# Altium project Gateway.PrjPCB
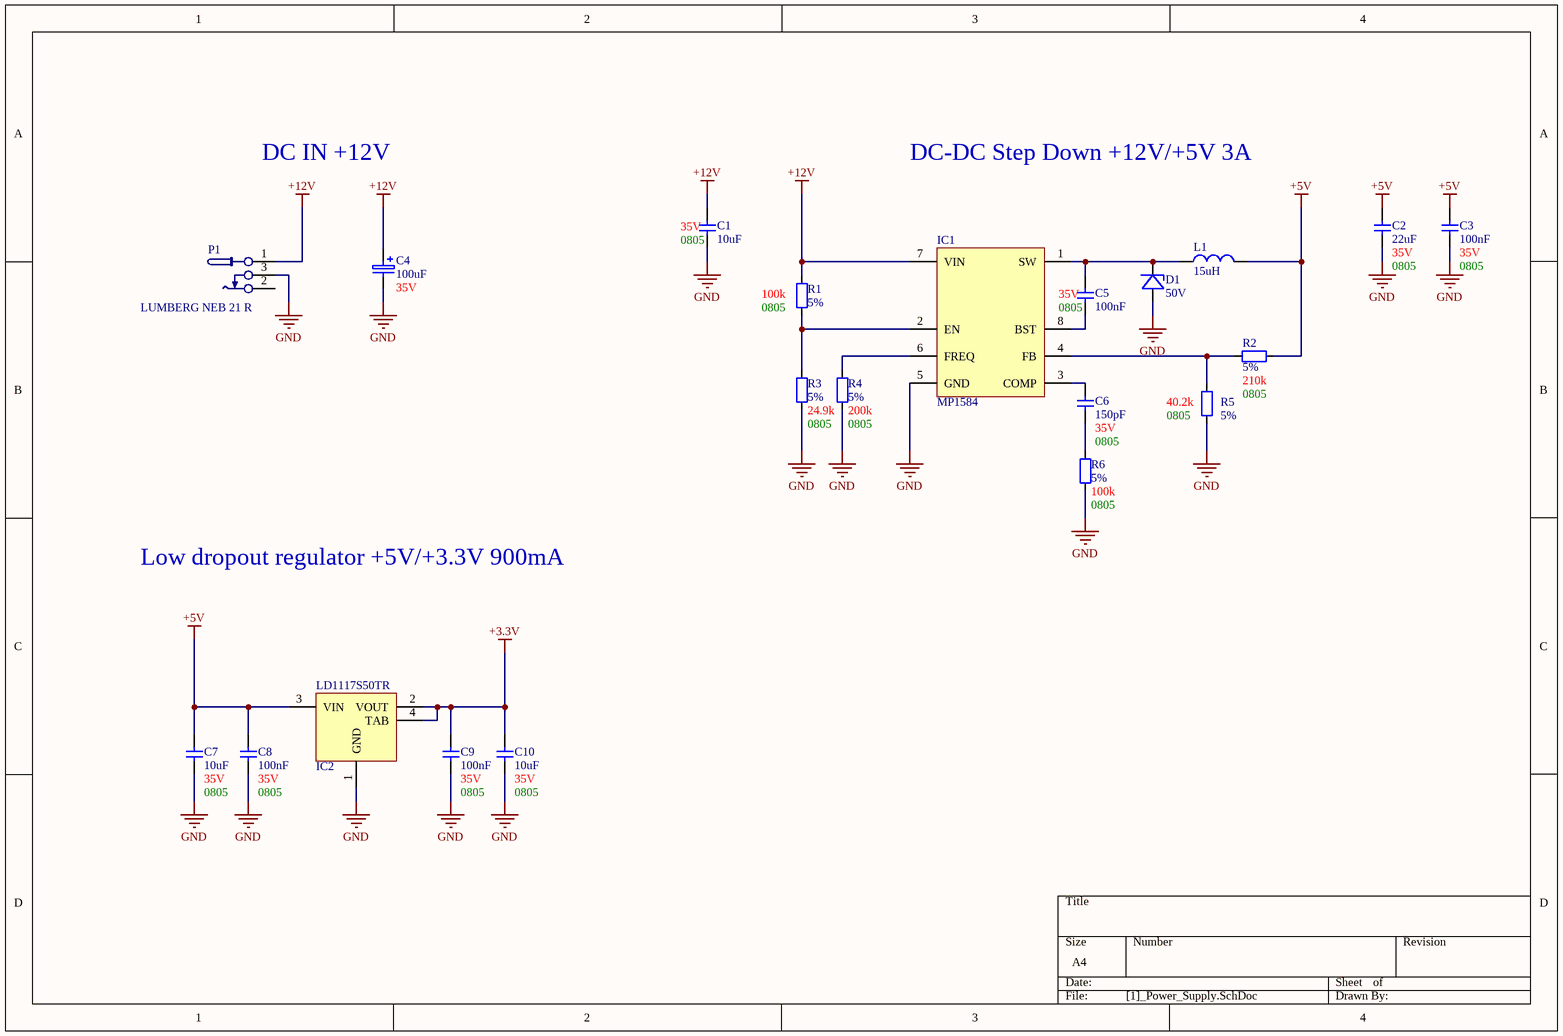
[diagram p0: [1]_Power_Supply.SchDoc]
4 sheets, 52 parts. Net scope: global (net labels, ports and power ports of the same name join across sheets).
Board file: PCB.PcbDoc
Sheets:
  [1]_Power_Supply.SchDoc
  [2]_PI_ZERO.SchDoc
  [3]_ENC28J60.SchDoc
  [4]_RFM95W.SchDoc

## Sheet [1]_Power_Supply.SchDoc
size A4

### Parts
C1  value 10uF  Voltage: 35V  Package: 0805  [Capacitor_0805]  (hidden comment: Capacitor SMD 0805)
C2  value 22uF  Voltage: 35V  Package: 0805  [Capacitor_0805]  (hidden comment: Capacitor SMD 0805)
C3  value 100nF  Voltage: 35V  Package: 0805  [Capacitor_0805]  (hidden comment: Capacitor SMD 0805)
C4  value 100uF  Voltage: 35V  [CAP_EL5x5.4mm]  (hidden comment: Polarized capacitor SMD  5x5.4mm)
C5  value 100nF  Voltage: 35V  Package: 0805  [Capacitor_0805]  (hidden comment: Capacitor SMD 0805)
C6  value 150pF  Voltage: 35V  Package: 0805  [Capacitor_0805]  (hidden comment: Capacitor SMD 0805)
C7  value 10uF  Voltage: 35V  Package: 0805  [Capacitor_0805]  (hidden comment: Capacitor SMD 0805)
C8  value 100nF  Voltage: 35V  Package: 0805  [Capacitor_0805]  (hidden comment: Capacitor SMD 0805)
C9  value 100nF  Voltage: 35V  Package: 0805  [Capacitor_0805]  (hidden comment: Capacitor SMD 0805)
C10  value 10uF  Voltage: 35V  Package: 0805  [Capacitor_0805]  (hidden comment: Capacitor SMD 0805)
D1  50V  [DO214-AA]
IC1  MP1584  [SOP8E]
IC2  LD1117S50TR  [SOT-223]
L1  15uH  [SDR0604-150YL]
P1  LUMBERG NEB 21 R  [LUMBERG_NEB_21R]
R1  Tolerance: 5%  Package: 0805  [R_0805]  (hidden comment: 100k)
R2  Tolerance: 5%  Package: 0805  [R_0805]  (hidden comment: 210k)
R3  Tolerance: 5%  Package: 0805  [R_0805]  (hidden comment: 24.9k)
R4  Tolerance: 5%  Package: 0805  [R_0805]  (hidden comment: 200k)
R5  Tolerance: 5%  Package: 0805  [R_0805]  (hidden comment: 40.2k)
R6  Tolerance: 5%  Package: 0805  [R_0805]  (hidden comment: 100k)

### Nets
+3.3V: C9.2 C10.1 IC2.2(VOUT) IC2.4(TAB)
+5V: C2.2 C3.2 C7.2 C8.1 IC2.3(VIN) L1.2 R2.2
+12V: C1.2 C4.1 IC1.7(VIN) P1.1 R1.2
GND: C1.1 C2.1 C3.1 C4.2 C7.1 C8.2 C9.1 C10.2 D1.A IC1.5(GND) IC1.9(THERM) IC2.1(GND) P1.3 R3.1 R4.1 R5.1 R6.1
NetC5_1: C5.1 IC1.8(BST)
NetC5_2: C5.2 D1.C IC1.1(SW) L1.1
NetC6_1: C6.1 R6.2
NetC6_2: C6.2 IC1.3(COMP)
NetIC1_2: IC1.2(EN) R1.1 R3.2
NetIC1_4: IC1.4(FB) R2.1 R5.2
NetIC1_6: IC1.6(FREQ) R4.2

Not connected (* = marked no-connect by the designer): P1 2

### Notes on the sheet
- Labels drawn without touching a wire or pin: DC IN +12V, DC-DC Step Down +12V/+5V 3A, Low dropout regulator +5V/+3.3V 900mA

### Library data of the parts
C1-C3 C5-C10 = Capacitor SMD 0805: Ceramic Capacitor SMD 0805; Tolerance: 10%
C4 = Polarized capacitor SMD  5x5.4mm: Electrolytic Capacitor SMD 5x5.4mm
D1 = Diode Rectifier RS3AB-13-F: RS3AB-13-F -Diode Standard 50V 3A Surface Mount SMB; MaxCurrent: Current
IC1 = MP1584: MP1584_3A, 1.5MHz, 28V_Step-Down Converter
IC2 = LD1117S50TR: LD1117S50TR - Fixed low drop positive voltage regulator
L1 = SDR0604-150YL: SDR0604-150YL - SMD Power Inductors
P1 = LUMBERG NEB 21 R: LUMBERG NEB 21 R DC Power Connector
R1-R6 = Resistor SMD 0805
  R1 R6: Value: 100k
  R2: Value: 210k
  R3: Value: 24.9k
  R4: Value: 200k
  R5: Value: 40.2k

## Sheet [2]_PI_ZERO.SchDoc
size A4
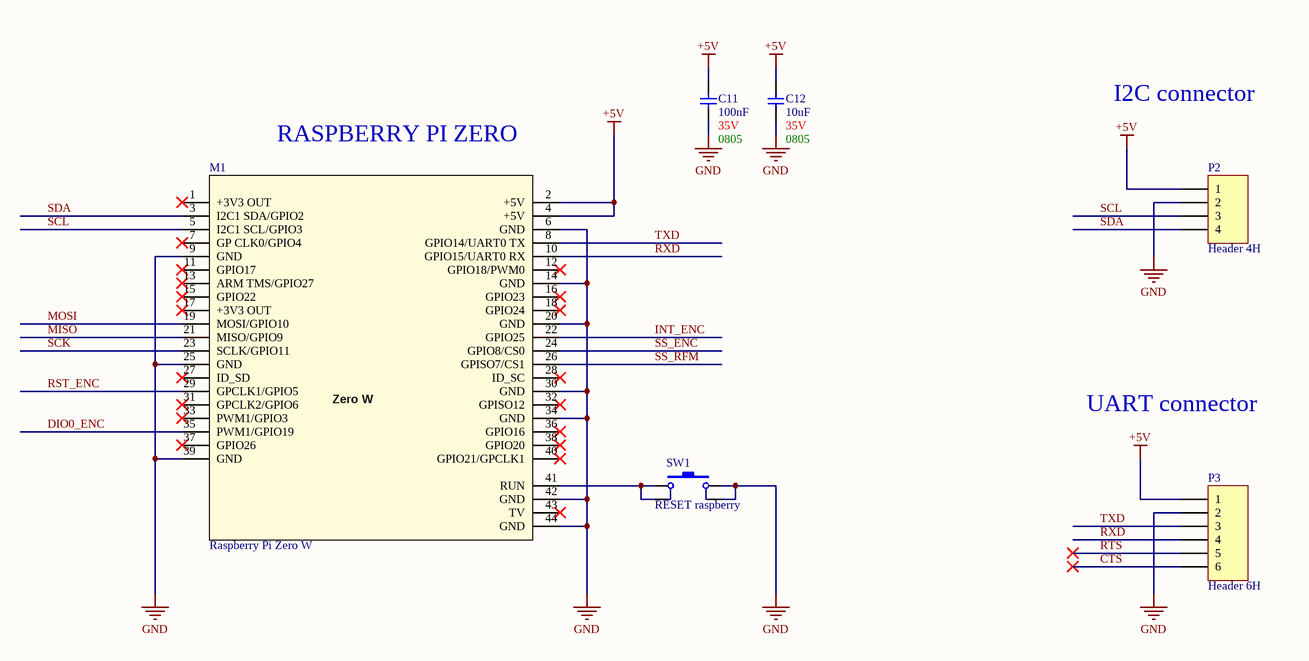
[diagram p1: [2]_PI_ZERO.SchDoc]

### Parts
C11  value 100nF  Voltage: 35V  Package: 0805  [Capacitor_0805]  (hidden comment: Capacitor SMD 0805)
C12  value 10uF  Voltage: 35V  Package: 0805  [Capacitor_0805]  (hidden comment: Capacitor SMD 0805)
M1  Raspberry Pi Zero W  [RPi-zero]
P2  Header 4H  [HDR1X4]
P3  Header 6H  [HDR1X6]
SW1  RESET raspberry  [Tact_SWITCH 6x6mm]

### Nets
+5V: C11.2 C12.2 M1.2(+5V) M1.4(+5V) P2.1 P3.1
GND: C11.1 C12.1 M1.6(GND) M1.9(GND) M1.14(GND) M1.20(GND) M1.25(GND) M1.30(GND) M1.34(GND) M1.39(GND) M1.42(GND) M1.44(GND) M1.45(M) M1.46(M) M1.47(M) M1.48(M) P2.2 P3.2 SW1.3 SW1.4
CTS: P3.6
DIO0_ENC: M1.35(PWM1/GPIO19)
INT_ENC: M1.22(GPIO25)
MISO: M1.21(MISO/GPIO9)
MOSI: M1.19(MOSI/GPIO10)
RST_ENC: M1.29(GPCLK1/GPIO5)
RTS: P3.5
RXD: M1.10(GPIO15/UART0_RX) P3.4
SCK: M1.23(SCLK/GPIO11)
SCL: M1.5(I2C1_SCL/GPIO3) P2.3
SDA: M1.3(I2C1_SDA/GPIO2) P2.4
SS_ENC: M1.24(GPIO8/CS0)
SS_RFM: M1.26(GPISO7/CS1)
TXD: M1.8(GPIO14/UART0_TX) P3.3
NetM1_41: M1.41(RUN) SW1.1 SW1.2

Not connected (* = marked no-connect by the designer): M1 1(+3V3_OUT)* 7(GP_CLK0/GPIO4)* 11(GPIO17)* 12(GPIO18/PWM0)* 13(ARM_TMS/GPIO27)* 15(GPIO22)* 16(GPIO23)* 17(+3V3_OUT)* 18(GPIO24)* 27(ID_SD)* 28(ID_SC)* 31(GPCLK2/GPIO6)* 32(GPISO12)* 33(PWM1/GPIO3)* 36(GPIO16)* 37(GPIO26)* 38(GPIO20)* 40(GPIO21/GPCLK1)* 43(TV)*

### Notes on the sheet
- Labels drawn without touching a wire or pin: I2C connector, RASPBERRY PI ZERO, UART connector
- (in symbol Raspberry Pi Zero W) Zero W

### Library data of the parts
C11 C12 = Capacitor SMD 0805: as C1 on sheet [1]_Power_Supply
M1 = Raspberry Pi Zero W: Raspberry Pi Zero W module
P2 = Header 4: Header, 4-Pin; LatestRevisionDate: 17-Jul-2002; LatestRevisionNote: Re-released for DXP Platform.; Publisher: Altium Limited
P3 = Header 6: Header, 6-Pin; LatestRevisionDate: 17-Jul-2002; LatestRevisionNote: Re-released for DXP Platform.; Publisher: Altium Limited
SW1 = Switch 6x6mm SMD SPST-NO: SCHURTER 1301.9315 - 6x6 mm tact switches

## Sheet [3]_ENC28J60.SchDoc
size A4
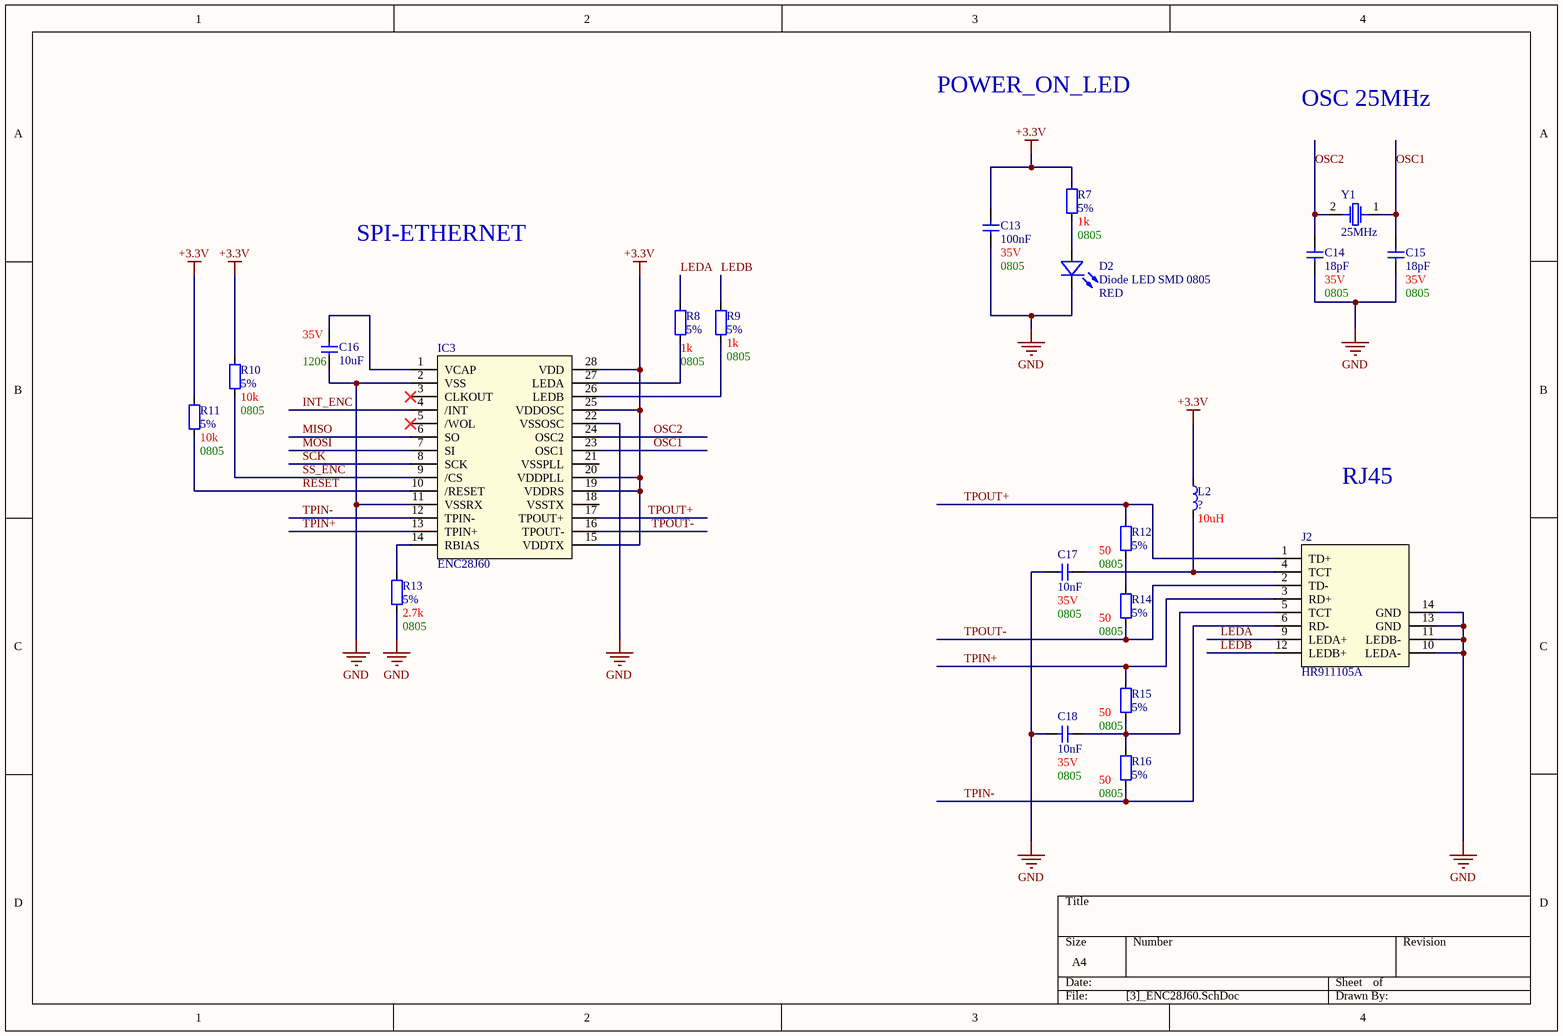
[diagram p2: [3]_ENC28J60.SchDoc]

### Parts
C13  value 100nF  Voltage: 35V  Package: 0805  [Capacitor_0805]  (hidden comment: Capacitor SMD 0805)
C14  value 18pF  Voltage: 35V  Package: 0805  [Capacitor_0805]  (hidden comment: Capacitor SMD 0805)
C15  value 18pF  Voltage: 35V  Package: 0805  [Capacitor_0805]  (hidden comment: Capacitor SMD 0805)
C16  value 10uF  Voltage: 35V  Package: 1206  [CAP_SMD_1206]  (hidden comment: Capacitor SMD 1206)
C17  value 10nF  Voltage: 35V  Package: 0805  [Capacitor_0805]  (hidden comment: Capacitor SMD 0805)
C18  value 10nF  Voltage: 35V  Package: 0805  [Capacitor_0805]  (hidden comment: Capacitor SMD 0805)
D2  Diode LED SMD 0805  Colour: RED  [Diode_LED_SMD_0805]
IC3  ENC28J60  [SO-28W]
J2  HR911105A  [HR911105A]
L2  ?  value 10uH  [IND_IHLP2525]
R7  Tolerance: 5%  Package: 0805  [R_0805]  (hidden comment: 1k)
R8  Tolerance: 5%  Package: 0805  [R_0805]  (hidden comment: 1k)
R9  Tolerance: 5%  Package: 0805  [R_0805]  (hidden comment: 1k)
R10  Tolerance: 5%  Package: 0805  [R_0805]  (hidden comment: 10k)
R11  Tolerance: 5%  Package: 0805  [R_0805]  (hidden comment: 10k)
R12  Tolerance: 5%  Package: 0805  [R_0805]  (hidden comment: 50)
R13  Tolerance: 5%  Package: 0805  [R_0805]  (hidden comment: 2.7k)
R14  Tolerance: 5%  Package: 0805  [R_0805]  (hidden comment: 50)
R15  Tolerance: 5%  Package: 0805  [R_0805]  (hidden comment: 50)
R16  Tolerance: 5%  Package: 0805  [R_0805]  (hidden comment: 50)
Y1  value 25MHz  [HC49SM]  (hidden comment: HC49SM)

### Nets
+3.3V: C13.2 IC3.15(VDDTX) IC3.19(VDDRS) IC3.20(VDDPLL) IC3.25(VDDOSC) IC3.28(VDD) L2.1 R7.2 R10.2 R11.1
GND: C13.1 C14.2 C15.2 C16.1 C17.1 C18.1 D2.C IC3.2(VSS) IC3.11(VSSRX) IC3.22(VSSOSC) J2.10(LEDA-) J2.11(LEDB-) J2.13(GND) J2.14(GND) R13.1
INT_ENC: IC3.4(/INT)
LEDA: J2.9(LEDA+) R8.2
LEDB: J2.12(LEDB+) R9.2
MISO: IC3.6(SO)
MOSI: IC3.7(SI)
OSC1: C15.1 IC3.23(OSC1) Y1.1
OSC2: C14.1 IC3.24(OSC2) Y1.2
RESET: IC3.10(/RESET) R11.2
SCK: IC3.8(SCK)
SS_ENC: IC3.9(/CS) R10.1
TPIN+: IC3.13(TPIN+) J2.3(RD+) R15.2
TPIN-: IC3.12(TPIN-) J2.6(RD-) R16.1
TPOUT+: IC3.17(TPOUT+) J2.1(TD+) R12.2
TPOUT-: IC3.16(TPOUT-) J2.2(TD-) R14.1
NetC16_2: C16.2 IC3.1(VCAP)
NetC17_2: C17.2 J2.4(TCT) L2.2
NetC18_2: C18.2 J2.5(TCT) R15.1 R16.2
NetD2_A: D2.A R7.1
NetIC3_14: IC3.14(RBIAS) R13.2
NetIC3_26: IC3.26(LEDB) R9.1
NetIC3_27: IC3.27(LEDA) R8.1
NetR12_1: R12.1 R14.2

Not connected (* = marked no-connect by the designer): IC3 3(CLKOUT)* 5(/WOL)* 18(VSSTX) 21(VSSPLL)

### Notes on the sheet
- Labels drawn without touching a wire or pin: OSC 25MHz, POWER_ON_LED, RJ45, SPI-ETHERNET

### Library data of the parts
C13-C15 C17 C18 = Capacitor SMD 0805: as C1 on sheet [1]_Power_Supply
C16 = Capacitor SMD 1206: Ceramic Capacitor SMD 1206; Tolerance: 10%
IC3 = ENC28J60: ENC28J60 - Stand-Alone Ethernet Controller  with SPI Interface
J2 = HR911105A: HR911105A - Ethernet connector RJ45
L2 = IHLP2525CZER150M01: Power Inductor IHLP2525 Series
R7-R16 = Resistor SMD 0805
  R7-R9: Value: 1k
  R10 R11: Value: 10k
  R12 R14-R16: Value: 50
  R13: Value: 2.7k
Y1 = HC49SM: HC49SM - Crystal oscilator

## Sheet [4]_RFM95W.SchDoc
size A4
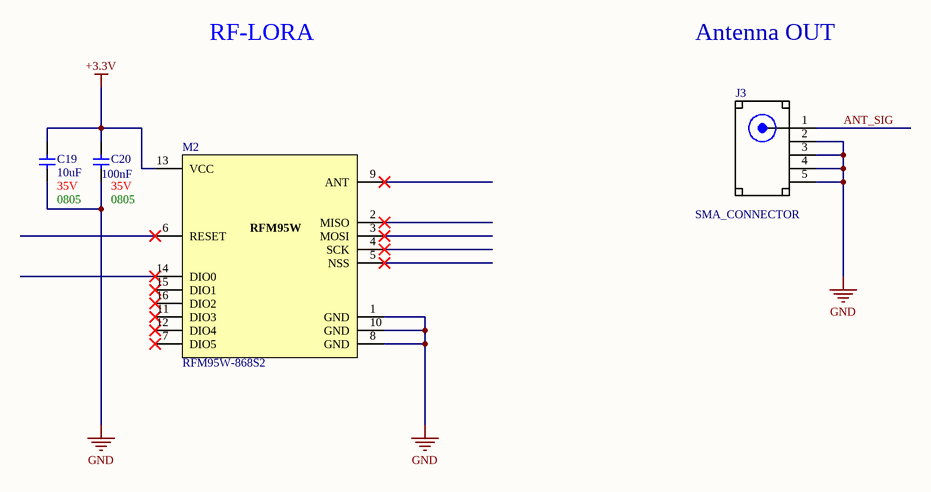
[diagram p3: [4]_RFM95W.SchDoc]

### Parts
C19  value 10uF  Voltage: 35V  Package: 0805  [Capacitor_0805]  (hidden comment: Capacitor SMD 0805)
C20  value 100nF  Voltage: 35V  Package: 0805  [Capacitor_0805]  (hidden comment: Capacitor SMD 0805)
J3  SMA_CONNECTOR  [LPRS_SMA_CONNECTOR]
M2  RFM95W-868S2  [RFM95W-868S2]

### Nets
+3.3V: C19.2 C20.2 M2.13(VCC)
GND: C19.1 C20.1 J3.2(GND) J3.3(GND) J3.4(GND) J3.5(GND) M2.1(GND) M2.8(GND) M2.10(GND)
ANT_SIG: J3.1(ANT)

Not connected (* = marked no-connect by the designer): M2 2(MISO)* 3(MOSI)* 4(SCK)* 5(NSS)* 6(RESET)* 7(DIO5)* 9(ANT)* 11(DIO3)* 12(DIO4)* 14(DIO0)* 15(DIO1)* 16(DIO2)*

### Notes on the sheet
- Labels drawn without touching a wire or pin: Antenna OUT, RF-LORA

### Library data of the parts
C19 C20 = Capacitor SMD 0805: as C1 on sheet [1]_Power_Supply
J3 = SMA_CONNECTOR: CONNECTOR, SMA, ANTENNA; SVHC: No SVHC _19-Dec-2012_; For Use With: Antenna; Kit Contents: SMA Connector; MF: LPRS; SnapEDA_Link: https://www.snapeda.com/parts/SMA%20CONNECTOR/LPRS/view-part/?ref=snap; Availability: Good; MP: SMA CONNECTOR; Package: None; Price: 1.03 USD; Value: *
M2 = RFM95W: HOPE MICROELECTRONICS RFM95W-868S2 - LoRa RF Module; Rule: PcbType=ProtelPcb

## Nets that join several sheets
+3.3V: [1]_Power_Supply (C9.2 C10.1 IC2.2 IC2.4), [3]_ENC28J60 (10 pins), [4]_RFM95W (C19.2 C20.2 M2.13)
+5V: [1]_Power_Supply (7 pins), [2]_PI_ZERO (6 pins)
GND: [1]_Power_Supply (17 pins), [2]_PI_ZERO (20 pins), [3]_ENC28J60 (15 pins), [4]_RFM95W (9 pins)
INT_ENC: [2]_PI_ZERO (M1.22), [3]_ENC28J60 (IC3.4)
MISO: [2]_PI_ZERO (M1.21), [3]_ENC28J60 (IC3.6)
MOSI: [2]_PI_ZERO (M1.19), [3]_ENC28J60 (IC3.7)
SCK: [2]_PI_ZERO (M1.23), [3]_ENC28J60 (IC3.8)
SS_ENC: [2]_PI_ZERO (M1.24), [3]_ENC28J60 (IC3.9 R10.1)